# Altium schematic sheet ESC_C.SchDoc
size A3; SheetNumber: 9; SheetTotal: 10
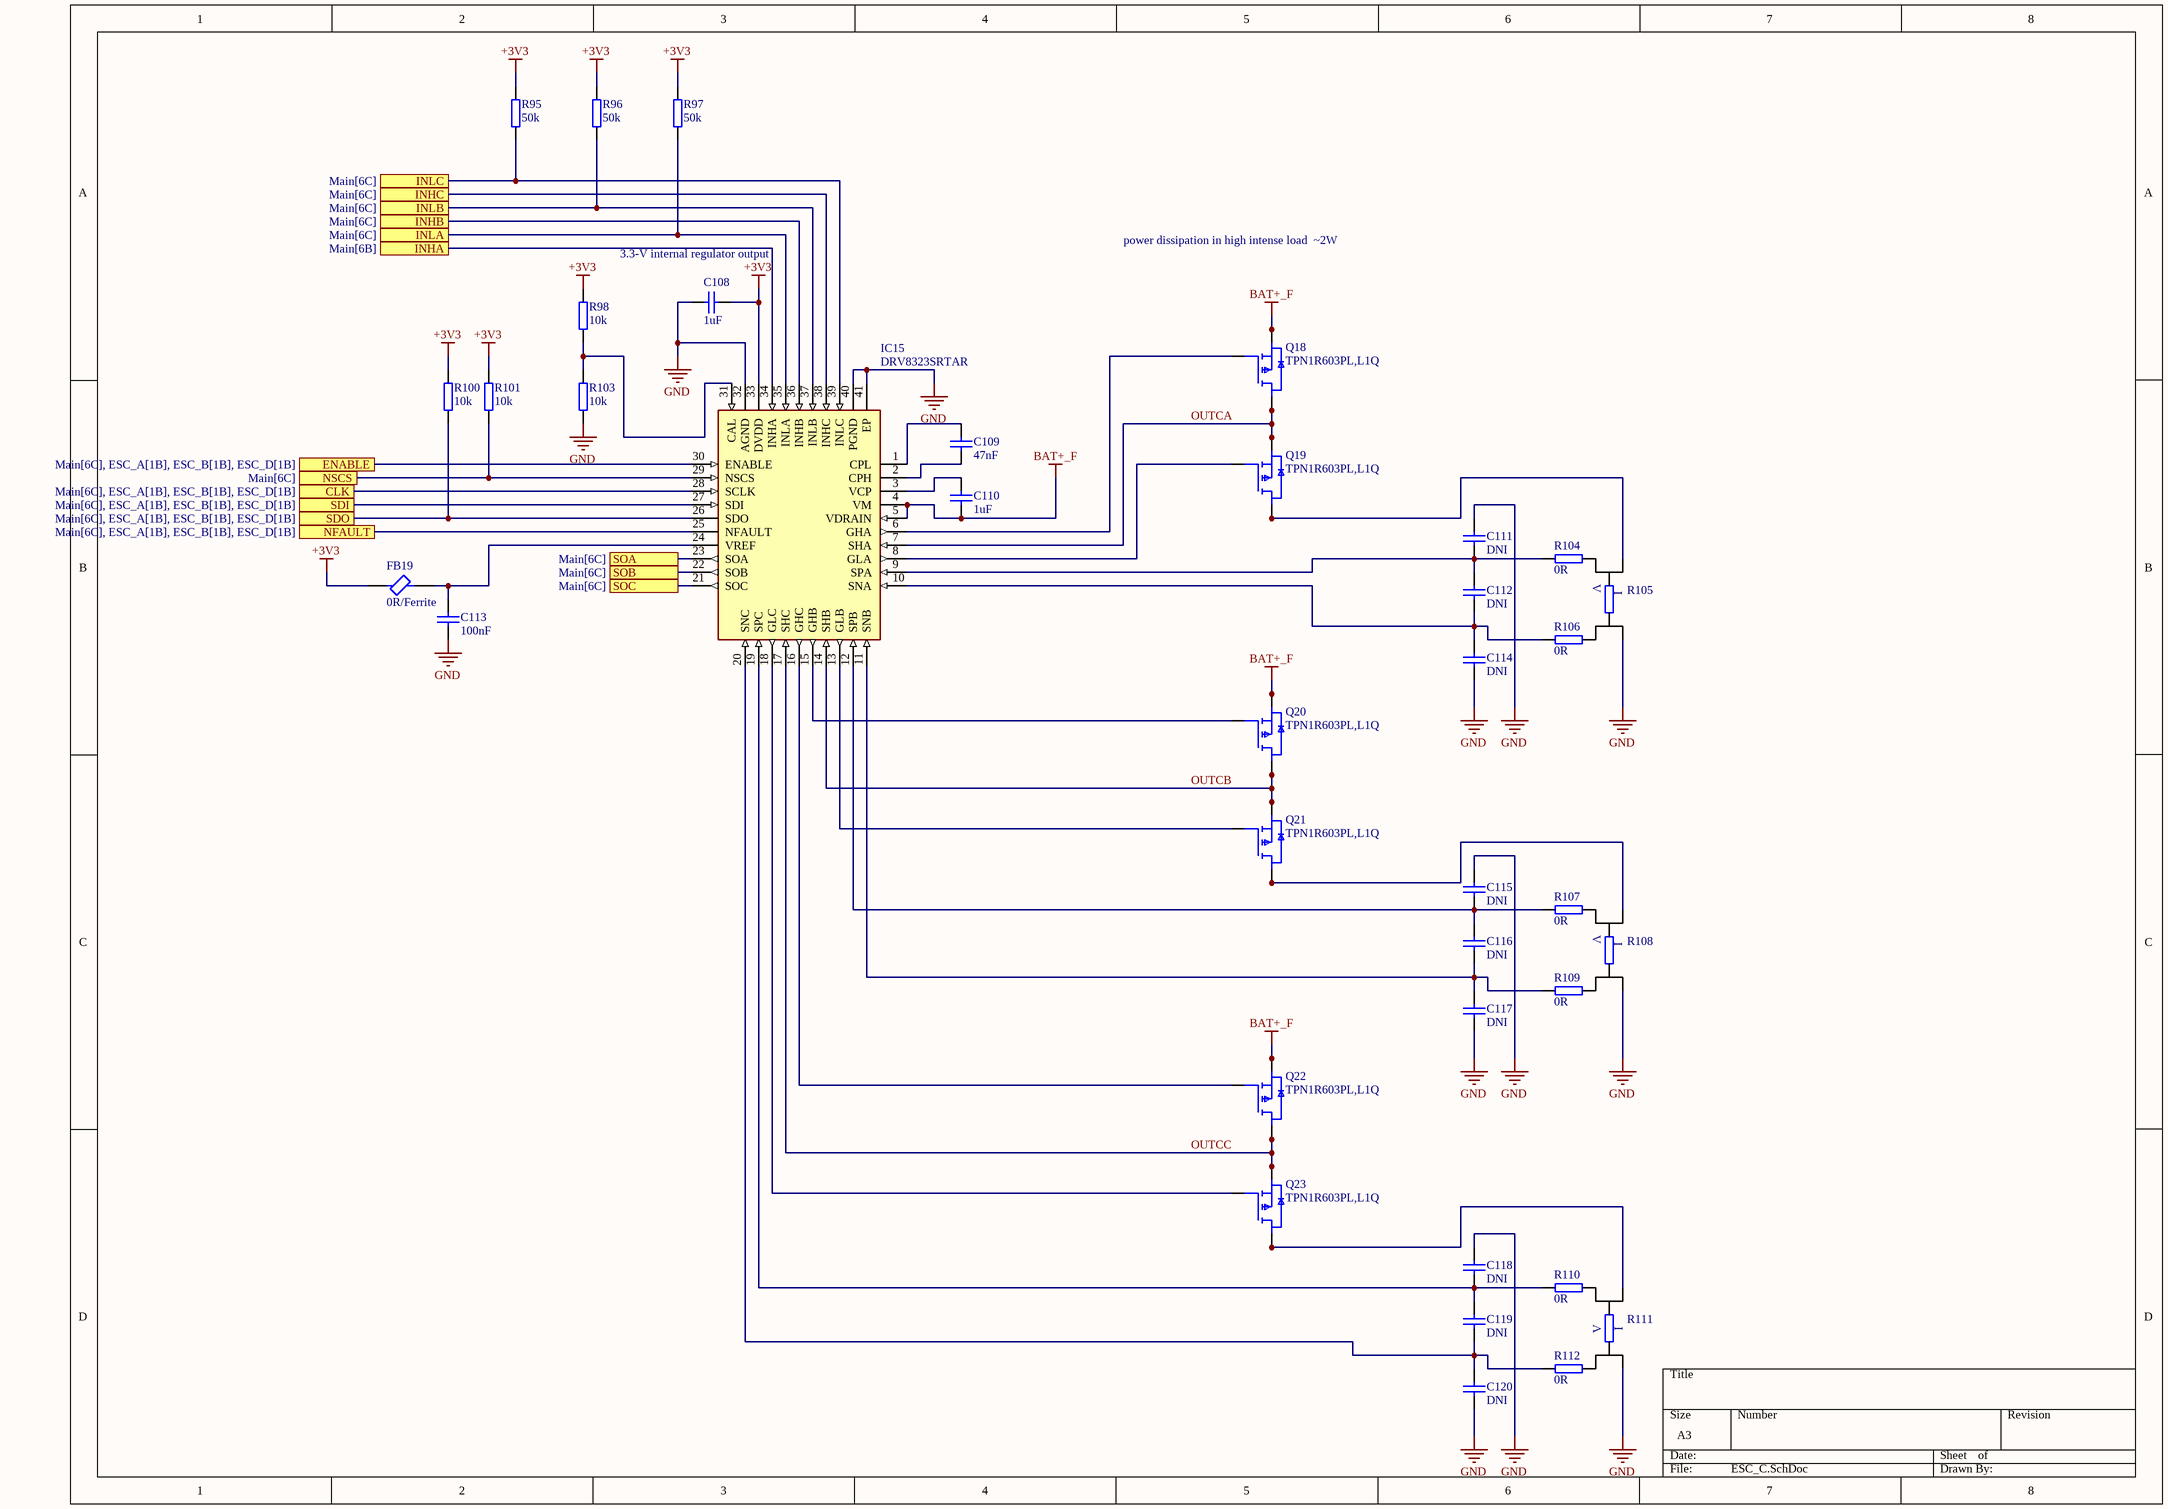
[diagram p0: ESC_C.SchDoc]

## Parts
C108  value 1uF  [CAP0402]  (hidden comment: Cap0402)
C109  value 47nF  [CAP0603]  (hidden comment: CapSMD0603)
C110  value 1uF  [CAP0603]  (hidden comment: CapSMD0603)
C111  value DNI  [CAP0402]  (hidden comment: Cap0402)
C112  value DNI  [CAP0402]  (hidden comment: Cap0402)
C113  value 100nF  [CAP0402]  (hidden comment: Cap0402)
C114  value DNI  [CAP0402]  (hidden comment: Cap0402)
C115  value DNI  [CAP0402]  (hidden comment: Cap0402)
C116  value DNI  [CAP0402]  (hidden comment: Cap0402)
C117  value DNI  [CAP0402]  (hidden comment: Cap0402)
C118  value DNI  [CAP0402]  (hidden comment: Cap0402)
C119  value DNI  [CAP0402]  (hidden comment: Cap0402)
C120  value DNI  [CAP0402]  (hidden comment: Cap0402)
FB19  0R/Ferrite  [NFZ15SG152SN10B]
IC15  DRV8323SRTAR  [QFN50P600X600X80-41N-D]
Q18  TPN1R603PL,L1Q  [TPN1R603PLL1Q]
Q19  TPN1R603PL,L1Q  [TPN1R603PLL1Q]
Q20  TPN1R603PL,L1Q  [TPN1R603PLL1Q]
Q21  TPN1R603PL,L1Q  [TPN1R603PLL1Q]
Q22  TPN1R603PL,L1Q  [TPN1R603PLL1Q]
Q23  TPN1R603PL,L1Q  [TPN1R603PLL1Q]
R95  value 50k  [RES0402]  (hidden comment: Res0402)
R96  value 50k  [RES0402]  (hidden comment: Res0402)
R97  value 50k  [RES0402]  (hidden comment: Res0402)
R98  value 10k  [RES0402]  (hidden comment: Res0402)
R100  value 10k  [RES0402]  (hidden comment: Res0402)
R101  value 10k  [RES0402]  (hidden comment: Res0402)
R103  value 10k  [RES0402]  (hidden comment: Res0402)
R104  value 0R  [RES0402]  (hidden comment: Res0402)
R105  WSK12161L000FEA  [WSK12161L000FEA]  (value not drawn)
R106  value 0R  [RES0402]  (hidden comment: Res0402)
R107  value 0R  [RES0402]  (hidden comment: Res0402)
R108  WSK12161L000FEA  [WSK12161L000FEA]  (value not drawn)
R109  value 0R  [RES0402]  (hidden comment: Res0402)
R110  value 0R  [RES0402]  (hidden comment: Res0402)
R111  WSK12161L000FEA  [WSK12161L000FEA]  (value not drawn)
R112  value 0R  [RES0402]  (hidden comment: Res0402)

## Ports
CLK (see Main[6C], ESC_A[1B], ESC_B[1B], ESC_D[1B]), ENABLE (see Main[6C], ESC_A[1B], ESC_B[1B], ESC_D[1B]), INHA (see Main[6B]), INHB (see Main[6C]), INHC (see Main[6C]), INLA (see Main[6C]), INLB (see Main[6C]), INLC (see Main[6C]), NFAULT (see Main[6C], ESC_A[1B], ESC_B[1B], ESC_D[1B]), NSCS (see Main[6C]), SDI (see Main[6C], ESC_A[1B], ESC_B[1B], ESC_D[1B]), SDO (see Main[6C], ESC_A[1B], ESC_B[1B], ESC_D[1B]), SOA (see Main[6C]), SOB (see Main[6C]), SOC (see Main[6C])

## Nets
+3V3: C108.2 FB19.1 IC15.33(DVDD) R95.2 R96.2 R97.2 R98.2 R100.2 R101.2
BAT+_F: C110.1 IC15.4(VM) IC15.5(VDRAIN) Q18.1(S_1) Q18.2(S_2) Q18.3(S_3) Q20.1(S_1) Q20.2(S_2) Q20.3(S_3) Q22.1(S_1) Q22.2(S_2) Q22.3(S_3)
GND: C108.1 C111.1 C113.1 C114.2 C115.1 C117.2 C118.1 C120.2 IC15.32(AGND) IC15.40(PGND) IC15.41(EP) R103.1 R105.4 R108.4 R111.1
CLK: IC15.28(SCLK) ; port CLK
ENABLE: IC15.30(ENABLE) ; port ENABLE
INHA: IC15.34(INHA) ; port INHA
INHB: IC15.36(INHB) ; port INHB
INHC: IC15.38(INHC) ; port INHC
INLA: IC15.35(INLA) R97.1 ; port INLA
INLB: IC15.37(INLB) R96.1 ; port INLB
INLC: IC15.39(INLC) R95.1 ; port INLC
NFAULT: IC15.25(NFAULT) ; port NFAULT
NSCS: IC15.29(NSCS) R101.1 ; port NSCS
OUTCA: IC15.7(SHA) Q18.5(D_1) Q18.6(D_2) Q18.7(D_3) Q18.8(D_4) Q18.9(D_4) Q19.1(S_1) Q19.2(S_2) Q19.3(S_3)
OUTCB: IC15.14(SHB) Q20.5(D_1) Q20.6(D_2) Q20.7(D_3) Q20.8(D_4) Q20.9(D_4) Q21.1(S_1) Q21.2(S_2) Q21.3(S_3)
OUTCC: IC15.17(SHC) Q22.5(D_1) Q22.6(D_2) Q22.7(D_3) Q22.8(D_4) Q22.9(D_4) Q23.1(S_1) Q23.2(S_2) Q23.3(S_3)
SDI: IC15.27(SDI) ; port SDI
SDO: IC15.26(SDO) R100.1 ; port SDO
SOA: IC15.23(SOA) ; port SOA
SOB: IC15.22(SOB) ; port SOB
SOC: IC15.21(SOC) ; port SOC
NetC109_1: C109.1 IC15.2(CPH)
NetC109_2: C109.2 IC15.1(CPL)
NetC110_2: C110.2 IC15.3(VCP)
NetC111_2: C111.2 C112.1 IC15.9(SPA) R104.1
NetC112_2: C112.2 C114.1 IC15.10(SNA) R106.1
NetC113_2: C113.2 FB19.2 IC15.24(VREF)
NetC115_2: C115.2 C116.1 IC15.12(SPB) R107.1
NetC116_2: C116.2 C117.1 IC15.11(SNB) R109.1
NetC118_2: C118.2 C119.1 IC15.19(SPC) R110.1
NetC119_2: C119.2 C120.1 IC15.20(SNC) R112.1
NetIC15_6: IC15.6(GHA) Q18.4(G)
NetIC15_8: IC15.8(GLA) Q19.4(G)
NetIC15_13: IC15.13(GLB) Q21.4(G)
NetIC15_15: IC15.15(GHB) Q20.4(G)
NetIC15_16: IC15.16(GHC) Q22.4(G)
NetIC15_18: IC15.18(GLC) Q23.4(G)
NetIC15_31: IC15.31(CAL) R98.1 R103.2
NetQ19_5: Q19.5(D_1) Q19.6(D_2) Q19.7(D_3) Q19.8(D_4) Q19.9(D_4) R105.1
NetQ21_5: Q21.5(D_1) Q21.6(D_2) Q21.7(D_3) Q21.8(D_4) Q21.9(D_4) R108.1
NetQ23_5: Q23.5(D_1) Q23.6(D_2) Q23.7(D_3) Q23.8(D_4) Q23.9(D_4) R111.4
NetR104_2: R104.2 R105.2
NetR105_3: R105.3 R106.2
NetR107_2: R107.2 R108.2
NetR108_3: R108.3 R109.2
NetR110_2: R110.2 R111.3
NetR111_2: R111.2 R112.2

## Notes on the sheet
- power dissipation in high intense load  ~2W
- 3.3-V internal regulator output
- (near IC15) Separate grounds?
- (in symbol WSK1216L5000FEA) V; I

## Library data of the parts
C108 = Cap0402: Voltage: val
C109 C110 = CapSMD0603: 50V; Published: 8-Jun-2000; LatestRevisionDate: 29-May-2009; LatestRevisionNote: IPC-7351 Footprint Added.; PackageReference: C1206; Publisher: Altium Limited; PackageDescription: Chip Capacitor
C113 = Cap0402: Voltage: 6V3
FB19 = BLM15PE471SH1D: Ferrite Bead; Manufacturer_Name: Murata Electronics; Datasheet Link: https://www.murata.com/en-global/products/productdetail.aspx?cate=luNoiseSupprFilteChipFerriBead&partno=BLM15PE471SH1%23; Height: 0.55mm; Manufacturer_Part_Number: BLM15PE471SH1D; Mouser Part Number: 81-BLM15PE471SH1D; Mouser Price/Stock: https://www.mouser.co.uk/ProductDetail/Murata-Electronics/BLM15PE471SH1D?qs=DRkmTr78QATAY5qAVx1hGA%3D%3D
IC15 = DRV8323SRTAR: Integrated Circuit; Manufacturer_Name: Texas Instruments; Datasheet Link: http://www.ti.com/lit/ds/symlink/drv8323.pdf; Height: 0.8mm; Manufacturer_Part_Number: DRV8323SRTAR; Mouser Part Number: 595-DRV8323SRTAR; Mouser Price/Stock: https://www.mouser.co.uk/ProductDetail/Texas-Instruments/DRV8323SRTAR?qs=u4fy%2FsgLU9P2gpPTX6mffg%3D%3D; Arrow Part Number: DRV8323SRTAR; Arrow Price/Stock: https://www.arrow.com/en/products/drv8323srtar/texas-instruments?utm_currency=USD&region=nac
Q18-Q23 = TPN1R603PL,L1Q: MOSFET (N-Channel); Manufacturer_Name: Toshiba; Datasheet Link: https://toshiba.semicon-storage.com/ap-en/semiconductor/product/mosfets/12v-300v-mosfets/detail.TPN1R603PL.html; Height: 0.9mm; Manufacturer_Part_Number: TPN1R603PL,L1Q; Mouser Part Number: 757-TPN1R603PLL1Q; Mouser Price/Stock: https://www.mouser.co.uk/ProductDetail/Toshiba/TPN1R603PLL1Q?qs=bUPhaerQQeGYpGlYi%252BLguw%3D%3D; Arrow Part Number: TPN1R603PL,L1Q; Arrow Price/Stock: https://www.arrow.com/en/products/tpn1r603pll1q/toshiba?utm_currency=USD&region=nac
R105 R108 R111 = WSK1216L5000FEA: Resistor; Manufacturer_Name: Vishay; Datasheet Link: http://www.vishay.com/docs/30189/wsk1216.pdf; Height: 1.9mm; Manufacturer_Part_Number: WSK1216L5000FEA; Mouser Part Number: 71-WSK1216L5000FEA; Mouser Price/Stock: https://www.mouser.co.uk/ProductDetail/Vishay-Dale/WSK1216L5000FEA?qs=OlC7AqGiEDlM2wGD42LFoQ%3D%3D; Arrow Part Number: WSK1216L5000FEA; Arrow Price/Stock: https://www.arrow.com/en/products/wsk1216l5000fea/vishay?region=nac
C111 C112 C114-C120 = Cap0402: Voltage: DNI